# Altium schematic sheet [19]-CAMERA_PWR_CONNECTORS.SchDoc
size A4
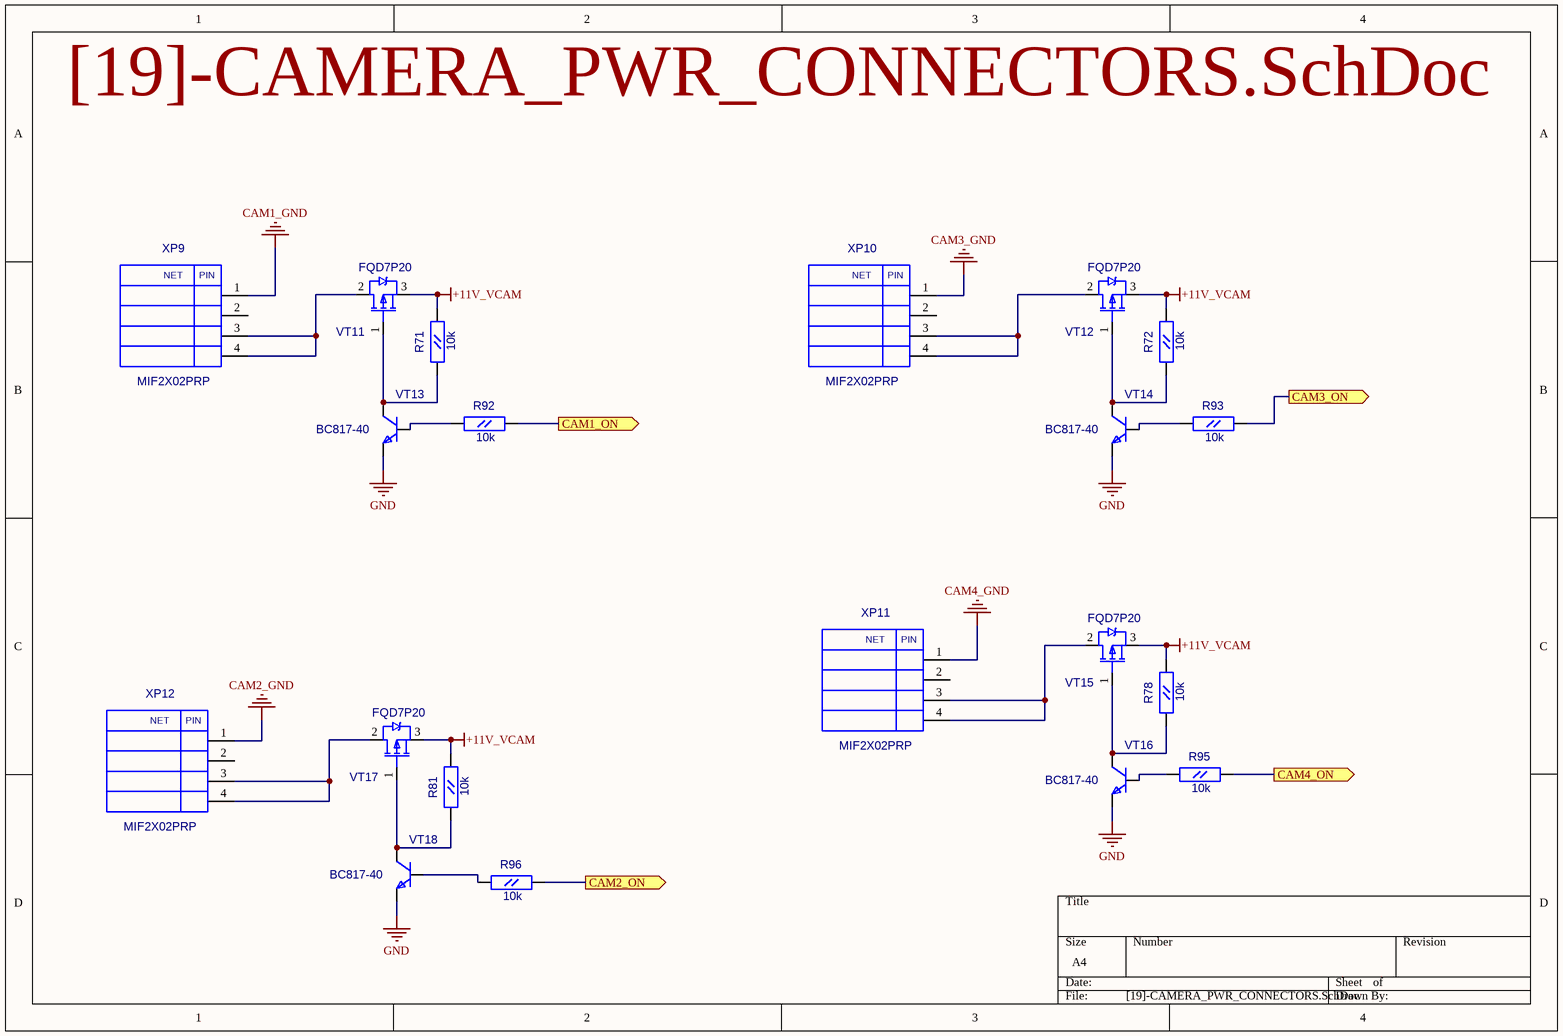
[diagram p0: [19]-CAMERA_PWR_CONNECTORS.SchDoc]

## Parts
R71  10k  [RC0603]
R72  10k  [RC0603]
R78  10k  [RC0603]
R81  10k  [RC0603]
R92  10k  [RC0603]
R93  10k  [RC0603]
R95  10k  [RC0603]
R96  10k  [RC0603]
VT11  FQD7P20  [D-PAK(TO-252AA)]
VT12  FQD7P20  [D-PAK(TO-252AA)]
VT13  BC817-40  [SOT-23(123)]
VT14  BC817-40  [SOT-23(123)]
VT15  FQD7P20  [D-PAK(TO-252AA)]
VT16  BC817-40  [SOT-23(123)]
VT17  FQD7P20  [D-PAK(TO-252AA)]
VT18  BC817-40  [SOT-23(123)]
XP9  MIF2X02PRP  [MIF2X02PRP]
XP10  MIF2X02PRP  [MIF2X02PRP]
XP11  MIF2X02PRP  [MIF2X02PRP]
XP12  MIF2X02PRP  [MIF2X02PRP]

## Ports
CAM1_ON (out), CAM2_ON (out), CAM3_ON (out), CAM4_ON (out)

## Nets
+11V_VCAM: R71.2(B) R72.2(B) R78.2(B) R81.2(B) VT11.3(S) VT12.3(S) VT15.3(S) VT17.3(S)
CAM1_GND: XP9.1
CAM2_GND: XP12.1
CAM3_GND: XP10.1
CAM4_GND: XP11.1
GND: VT13.2(E) VT14.2(E) VT16.2(E) VT18.2(E)
CAM1_ON: R92.2(B) ; port CAM1_ON
CAM2_ON: R96.2(B) ; port CAM2_ON
CAM3_ON: R93.2(B) ; port CAM3_ON
CAM4_ON: R95.2(B) ; port CAM4_ON
NetR71_1: R71.1(A) VT11.1(G) VT13.3(C)
NetR72_1: R72.1(A) VT12.1(G) VT14.3(C)
NetR78_1: R78.1(A) VT15.1(G) VT16.3(C)
NetR81_1: R81.1(A) VT17.1(G) VT18.3(C)
NetR92_1: R92.1(A) VT13.1(B)
NetR93_1: R93.1(A) VT14.1(B)
NetR95_1: R95.1(A) VT16.1(B)
NetR96_1: R96.1(A) VT18.1(B)
NetVT11_2: VT11.2(D) XP9.3 XP9.4
NetVT12_2: VT12.2(D) XP10.3 XP10.4
NetVT15_2: VT15.2(D) XP11.3 XP11.4
NetVT17_2: VT17.2(D) XP12.3 XP12.4

Not connected (* = marked no-connect by the designer): XP9 2; XP10 2; XP11 2; XP12 2

## Notes on the sheet
- (in symbol MIF2X02PRP) NET; PIN

## Library data of the parts
R71 R72 R78 R81 R92 R93 R95 R96 = RC0603: Value: 10k
VT11 VT12 VT15 VT17 = IRFR9220: HEXFET Power MOSFET; OriginalName: IRLML5103; ComponentField7: Published 8-Jun-2000; Value: FQD7P20
VT13 VT14 VT16 VT18 = BC846BLT1: NPN 500ma transistor; ComponentField7: Published 29-Sep-2000; OriginalName: BC846BLT1; Value: BC817-40
XP9-XP12 = MIF2X02PRP: Value: *